# EasyEDA Pro project GeekTrack.eprj

# Schematic GeekTrack
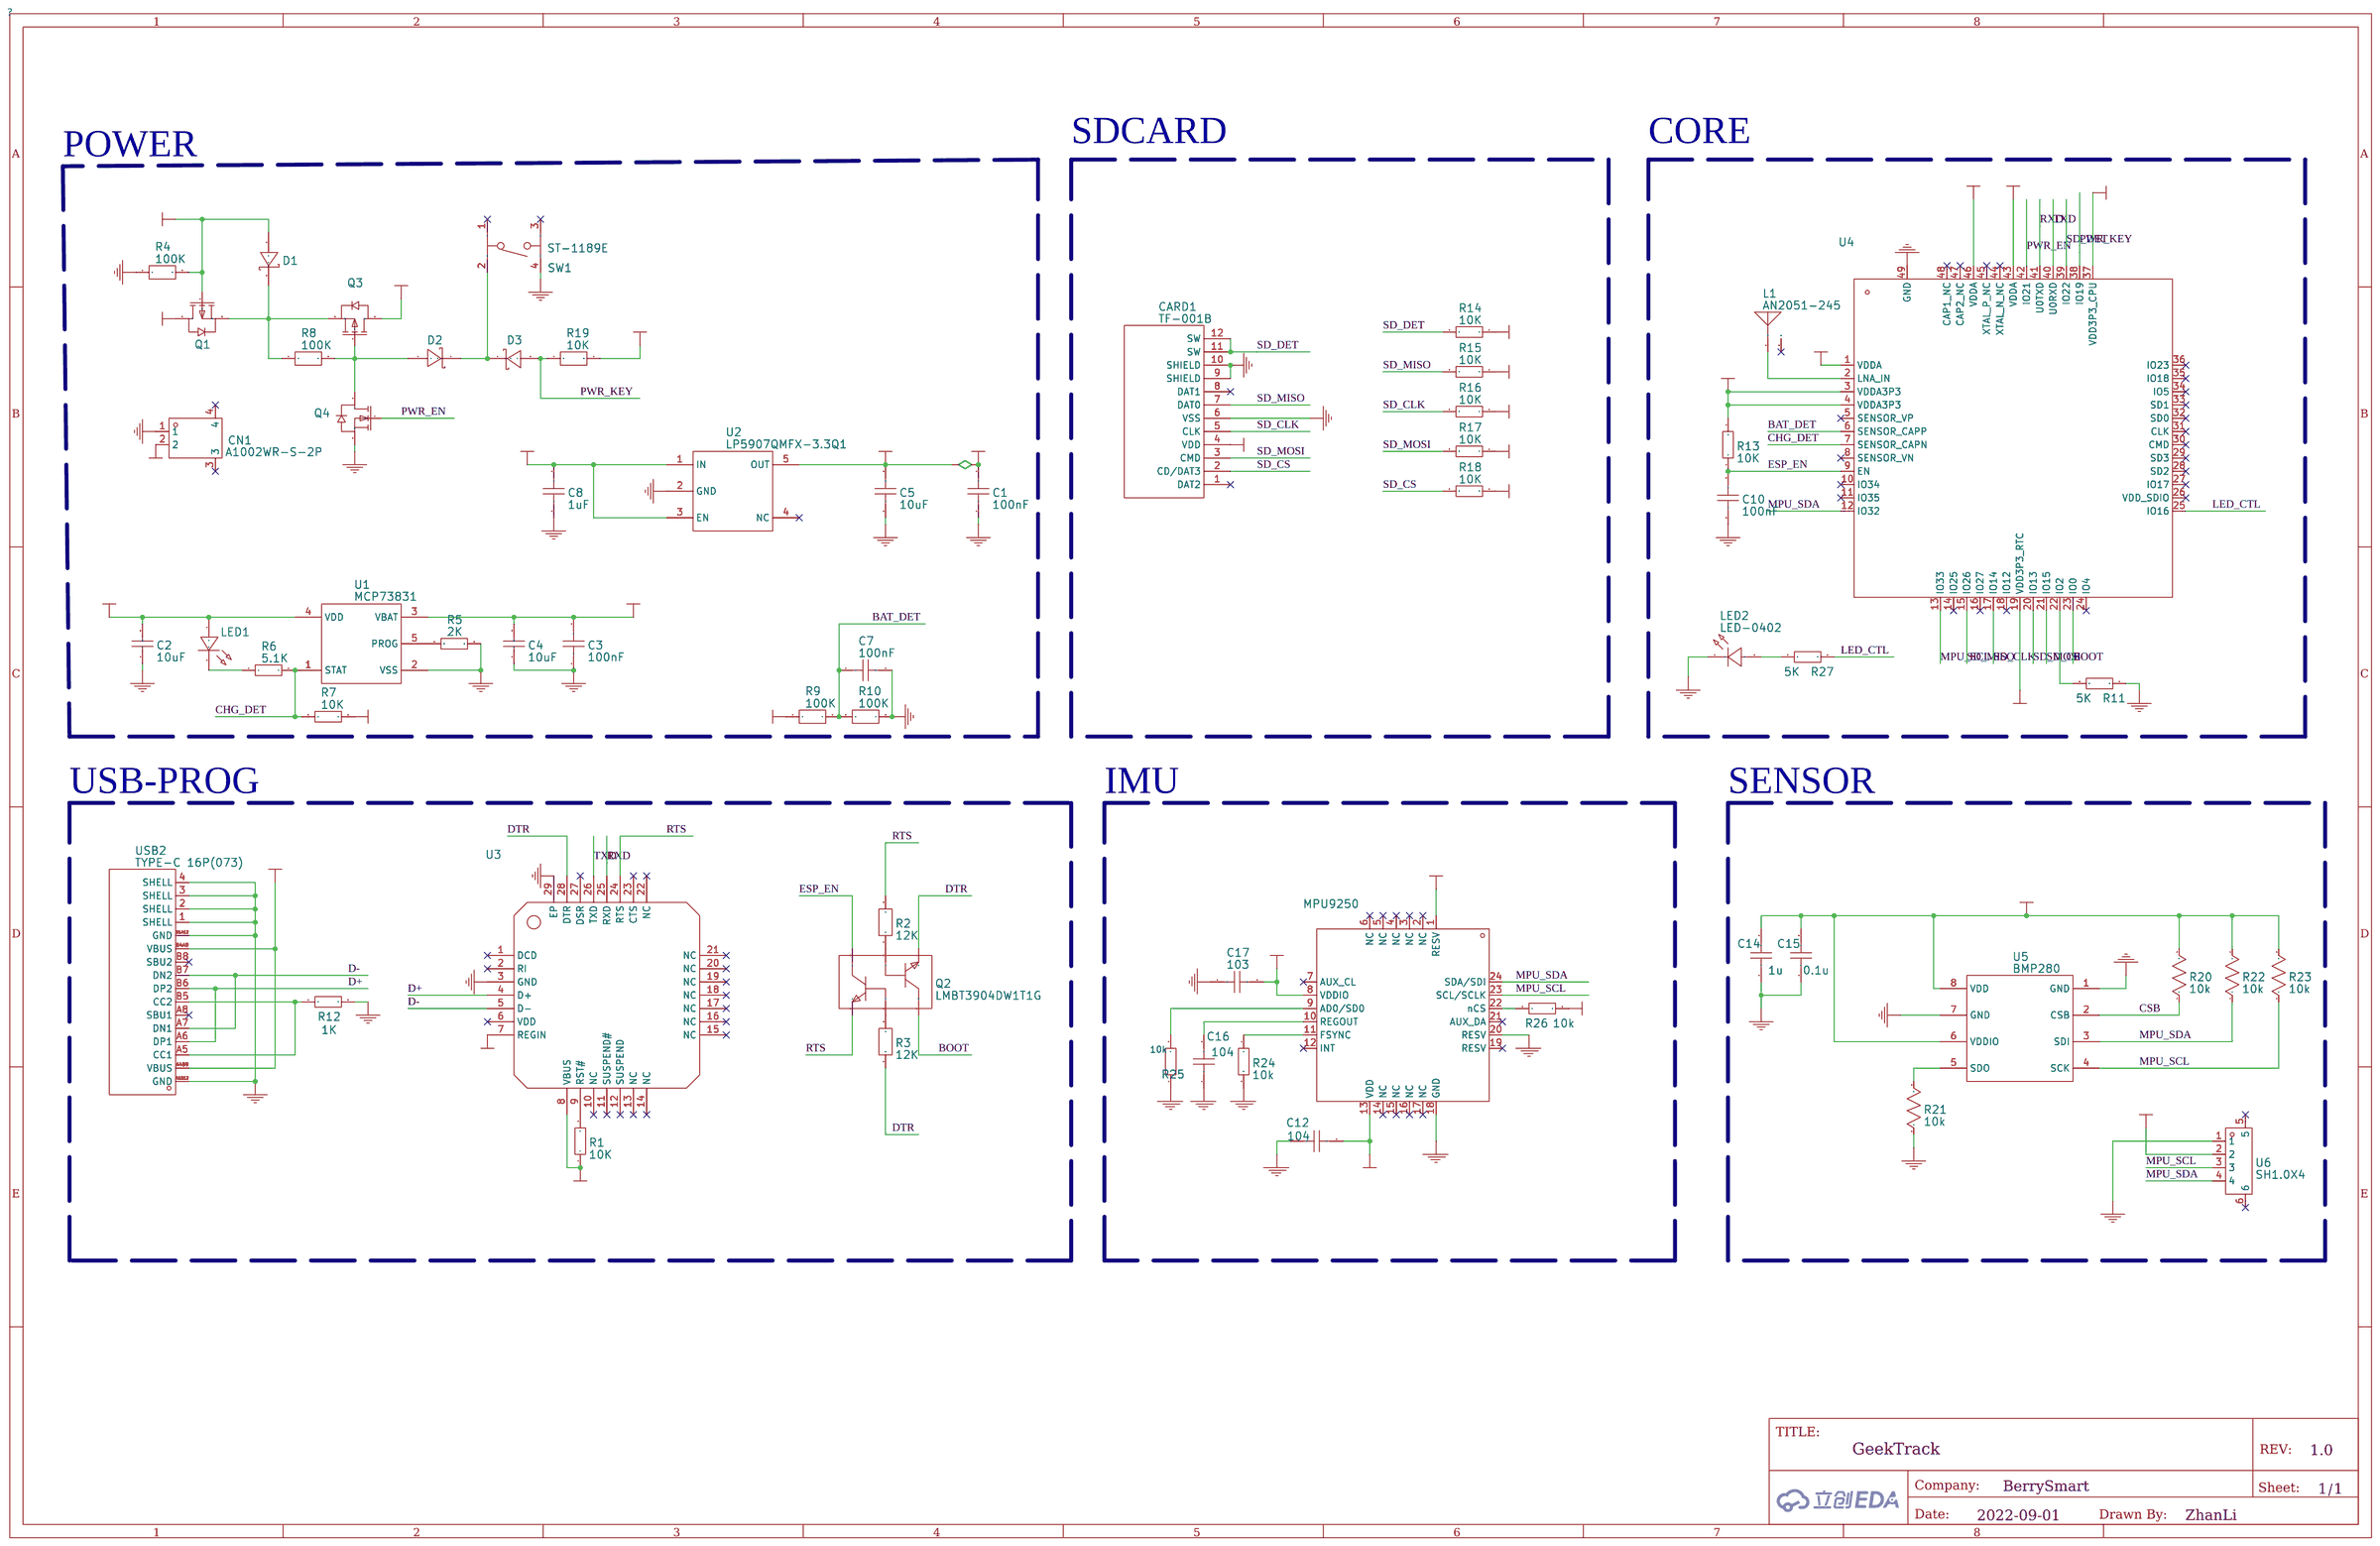
[diagram p0: schematic sheet]

## Parts
C1  100nF  [C0402]
C2  10uF  [C0402]
C3  100nF  [C0402]
C4  10uF  [C0402]
C5  10uF  [C0402]
C7  100nF  [C0402]
C8  1uF  [C0402]
C10  100nF  [C0402]
C12  104  [C0402]
C14  1u  [R0402]
C15  0.1u  [R0402]
C16  104  [C0402]
C17  103  [C0402]
CARD1  TF-001B  [TF-SMD_TF-001B]
CN1  A1002WR-S-2P  [CONN-SMD_A1002WR-S-2P]
D1  B5819WS_C122855  [SOD-323_L1.8-W1.3-LS2.5-RD]
D2  B5819WS_C122855  [SOD-323_L1.8-W1.3-LS2.5-RD]
D3  B5819WS_C122855  [SOD-323_L1.8-W1.3-LS2.5-RD]
L1  AN2051-245  [ANT2051]
LED1  LED-0603_R  [LED0603_RED]
LED2  LED-0402  [LED0402-RD]
MPU9250  MPU9250  [MPU9250]
Q1  AO3401A_C700954  [SOT-23-3_L2.9-W1.3-P1.90-LS2.4-BR]
Q2  LMBT3904DW1T1G  [SOT-363_L2.0-W1.3-P0.65-LS2.1-TL]
Q3  AO3401A_C700954  [SOT-23-3_L2.9-W1.3-P1.90-LS2.4-BR]
Q4  AO3400A_C700953  [SOT-23-3_L2.9-W1.3-P1.90-LS2.4-BR]
R1  10K  [R0402]
R2  12K  [R0402]
R3  12K  [R0402]
R4  100K  [R0402]
R5  2K  [R0402]
R6  5.1K  [R0402]
R7  10K  [R0402]
R8  100K  [R0402]
R9  100K  [R0402]
R10  100K  [R0402]
R11  5K  [R0402]
R12  1K  [R0402]
R13  10K  [R0402]
R14  10K  [R0402]
R15  10K  [R0402]
R16  10K  [R0402]
R17  10K  [R0402]
R18  10K  [R0402]
R19  10K  [R0402]
R20  10k  [R0402]
R21  10k  [R0402]
R22  10k  [R0402]
R23  10k  [R0402]
R24  10k  [R0402]
R25  10k  [R0402]
R26  10k  [R0402]
R27  5K  [R0402]
SW1  ST-1189E  [SW-SMD_ST-1189E]
U1  MCP73831  [SOT-23-5_L3.0-W1.7-P0.95-LS2.8-BR]
U2  LP5907QMFX-3.3Q1  [SOT-23-5_L3.0-W1.7-P0.95-LS2.8-BR]
U3  CP2102-GMR  [QFN-28_L5.0-W5.0-P0.50-BL-EP]
U4  ESP32-PICO-D4  [QFN-48_7X7X05P]
U5  BMP280  [SENSOR-TH_BMP280-BL]
U6  SH1.0X4  [CONN-SMD_SH1.0X4]
USB2  TYPE-C 16P(073)  [USB-C-SMD_TYPE-C16PIN_C668624]

## Library data of the parts
C1 C3 C7 C10 = CC0402KRX5R5BB104: Supplier: LCSC; Supplier Part: C541405; Manufacturer: YAGEO
C2 C4 = CL05A106MQ5NUNC: Supplier: LCSC; Manufacturer: SAMSUNG; Supplier Part: C15525; JLCPCB Part Class: Basic Part
C5 C8 = C0402C105K9PAC7867: Supplier: LCSC; Supplier Part: C141025; Manufacturer: KEMET; JLCPCB Part Class: Extended Part
C12 C16 = 104: link: https://item.szlcsc.com/15869.html; 3DModel: C0402_L1.0-W0.5-H0.5; Manufacturer Part: ?
C14 = 1u: link: https://item.szlcsc.com/323315.html; 3DModel: R0402_L1.0-W0.5-H0.5
C15 = 0.1u: link: https://item.szlcsc.com/323315.html; 3DModel: R0402_L1.0-W0.5-H0.5
C17 = 103: link: https://item.szlcsc.com/15869.html; 3DModel: C0402_L1.0-W0.5-H0.5; Manufacturer Part: ?
CARD1 = TF-001B: Supplier: LCSC; Manufacturer: SOFNG; Supplier Part: C125617; JLCPCB Part Class: Extended Part
CN1 = A1002WR-S-2P: Supplier: LCSC; Supplier Part: C239520; Manufacturer: Changjiang Connectors; JLCPCB Part Class: Extended Part
D1 = B5819WS: Supplier: LCSC; Manufacturer: SK; Supplier Part: C122855; JLCPCB Part Class: Extended Part
D2 D3 = B5819WS_C122855: link: https://item.szlcsc.com/295156.html; 3DModel: SOD-323_L1.7-W1.3-H1.1-LS2.5; Supplier: LCSC; Manufacturer: SK; Manufacturer Part: B5819WS; Supplier Part: C122855; JLCPCB Part Class: Extended Part
L1 = AN2051-245: Supplier: LCSC; Manufacturer: Rainsun; Supplier Part: C99727; JLCPCB Part Class: Extended Part
LED1 = 19-217/R6C-AL1M2VY/3T: Manufacturer: EVERLIGHT(台湾亿光); Supplier Part: C72044; Supplier: LCSC
LED2 = LED-0402: link: https://item.szlcsc.com/385873.html; 3DModel: LED0402_L1.0-W0.5-H0.2; Supplier: LCSC; Supplier Part: C917191; Manufacturer: TOGIALED; Manufacturer Part: TJ-S1005CL4T5ALC3DW-A5; JLCPCB Part Class: Extended Part
MPU9250 = MPU9250: Manufacturer Part: ?; 3DModel: QFN24_L4.0-W4.0-H1.0-P0.50
Q1 Q3 = AO3401A: Supplier: LCSC; Supplier Part: C700954; Manufacturer: HUASHUO(华朔); JLCPCB Part Class: Extended Part
Q2 = LMBT3904DW1T1G: Supplier: LCSC; Manufacturer: LRC; Supplier Part: C131781; JLCPCB Part Class: Extended Part
Q4 = AO3400A: Supplier: LCSC; Supplier Part: C700953; Manufacturer: HUASHUO(华朔); JLCPCB Part Class: Extended Part
R1 R7 R13-R18 = CR0402JF0103G: Supplier: LCSC; Manufacturer: LIZ; Supplier Part: C100572; JLCPCB Part Class: Extended Part
R2 R3 = CR0402F12K0Q10Z: Supplier: LCSC; Supplier Part: C881068; Manufacturer: Ever Ohms Tech
R4 R8-R10 = CR0402F100KQ10Z: Supplier: LCSC; Supplier Part: C881385; Manufacturer: Ever Ohms Tech
R5 = CR0402FF2001G: Supplier: LCSC; Manufacturer: LIZ; Supplier Part: C100291; JLCPCB Part Class: Extended Part
R6 R12 = RC0402JR-071KL: Supplier: LCSC; Manufacturer: YAGEO; Supplier Part: C105637; JLCPCB Part Class: Extended Part
R11 R27 = 5K: link: https://item.szlcsc.com/323315.html; 3DModel: R0402_L1.0-W0.5-H0.5; Supplier: LCSC; Manufacturer: LIZ; Manufacturer Part: CR0402JF0103G; Supplier Part: C100572; JLCPCB Part Class: Extended Part
R19 = 10K: link: https://item.szlcsc.com/323315.html; 3DModel: R0402_L1.0-W0.5-H0.5; Supplier: LCSC; Supplier Part: C881385; Manufacturer: Ever Ohms Tech; Manufacturer Part: CR0402F100KQ10Z
R20-R23 = 10k: link: https://item.szlcsc.com/323315.html; 3DModel: R0402_L1.0-W0.5-H0.5
R24-R26 = 10k: link: https://item.szlcsc.com/323315.html; 3DModel: R0402_L1.0-W0.5-H0.5; Manufacturer Part: ?
SW1 = ST-1189E: link: https://item.szlcsc.com/617095.html; Supplier: LCSC; Supplier Part: C589215; Manufacturer: RI SHENG; JLCPCB Part Class: Extended Part
U1 = MCP73831T-2ATI/OT: Supplier: LCSC; Manufacturer: MICROCHIP; Supplier Part: C14879; JLCPCB Part Class: Extended Part
U2 = LP5907QMFX-3.3Q1: Supplier: LCSC; Manufacturer: TI; Supplier Part: C130005; JLCPCB Part Class: Extended Part
U3 = CP2102-GMR: Supplier: LCSC; Manufacturer: SILICON LABS; Supplier Part: C6568; JLCPCB Part Class: Basic Part
U4 = ESP32-PICO-D4: Supplier: LCSC; Supplier Part: C193707; Manufacturer: Espressif Systems
U5 = BMP280: 3DModel: LGA-8_L2.0-W2.5-H1.0-P0.65; Supplier: LCSC; Manufacturer: Bosch; Supplier Part: C83291; JLCPCB Part Class: Extend
U6 = SH1.0X4: link: https://cn.bing.com/search?q=datasheet: SH1.0X4; Supplier: LCSC; Supplier Part: C9900002342; Manufacturer: null; Manufacturer Part: SH1.0X4卧贴; JLCPCB Part Class: Extended Part
USB2 = TYPE-C 16P(073): Supplier: LCSC; Supplier Part: C668624; Manufacturer: SHOU HAN

## Nets
3V3A: C1.2 C5.2 C12.2 C14.2 C15.2 C17.2 CARD1.4(VDD) MPU9250.1(RESV) MPU9250.8(VDDIO) MPU9250.13(VDD) R7.2 R13.2 R14.1 R15.1 R16.1 R17.1 R18.1 R19.2 R20.2 R22.2 R23.2 R26.2 U2.5(OUT) U4.1(VDDA) U4.3(VDDA3P3) U4.4(VDDA3P3) U4.19(VDD3P3_RTC) U4.37(VDD3P3_CPU) U4.43(VDDA) U4.46(VDDA) U5.6(VDDIO) U5.8(VDD) U6.2
GND: C1.1 C2.1 C3.1 C4.1 C5.1 C7.2 C8.1 C10.1 C12.1 C14.1 C15.1 C16.1 C17.1 CARD1.6(VSS) CARD1.9(SHIELD) CARD1.10(SHIELD) CN1.1 LED2.1(K) MPU9250.18(GND) MPU9250.20(RESV) Q4.2(S) R4.1 R5.2 R10.2 R11.1 R12.2 R21.1 R24.2 R25.1 SW1.4 U1.2(VSS) U2.2(GND) U3.3(GND) U3.29(EP) U4.49(GND) U5.1(GND) U5.7(GND) U6.1 USB2.1(SHELL) USB2.2(SHELL) USB2.3(SHELL) USB2.4(SHELL) USB2.A1B12(GND) USB2.B1A12(GND)
VBAT: C3.2 C4.2 CN1.2 Q1.3(D) U1.3(VBAT)
VCC: C8.2 Q3.3(D) R9.1 U2.1(IN) U2.3(EN)
BAT_DET: C7.1 R9.2 R10.1 U4.6(SENSOR_CAPP)
BOOT: Q2.3(C) U4.23(IO0)
CHG_DET: R6.2 R7.1 U1.1(STAT) U4.7(SENSOR_CAPN)
CSB: R20.1 U5.2(CSB)
D+: U3.4(D+) USB2.A6(DP1) USB2.B6(DP2)
D-: U3.5(D-) USB2.A7(DN1) USB2.B7(DN2)
DTR: Q2.4(E) R3.1 U3.28(DTR)
ESP_EN: C10.2 Q2.6(C) R13.1 U4.9(EN)
LED_CTL: R27.1 U4.25(IO16)
MPU_SCL: MPU9250.23(SCL/SCLK) R23.1 U4.13(IO33) U5.4(SCK) U6.3
MPU_SDA: MPU9250.24(SDA/SDI) R22.1 U4.12(IO32) U5.3(SDI) U6.4
PWR_EN: Q4.1(G) U4.42(IO21)
PWR_KEY: D3.2(A) R19.1 U4.38(IO19)
RTS: Q2.1(E) R2.2 U3.24(RTS)
RXD: U3.25(RXD) U4.41(U0TXD)
SD_CLK: CARD1.5(CLK) R16.2 U4.17(IO14)
SD_CS: CARD1.2(CD/DAT3) R18.2 U4.21(IO15)
SD_DET: CARD1.11(SW) CARD1.12(SW) R14.2 U4.39(IO22)
SD_MISO: CARD1.7(DAT0) R15.2 U4.15(IO26)
SD_MOSI: CARD1.3(CMD) R17.2 U4.20(IO13)
TXD: U3.26(TXD) U4.40(U0RXD)
VUSB: C2.2 D1.2(A) LED1.1 Q1.1(G) R1.1 R4.2 U1.4(VDD) U3.7(REGIN) U3.8(VBUS) USB2.A4B9(VBUS) USB2.B4A9(VBUS)
Net-(C16-2): C16.2 MPU9250.10(REGOUT)
Net-(D1-1): D1.1(K) Q1.2(S) Q3.2(S) R8.1
Net-(D2-1): D2.1(K) D3.1(K) SW1.2
Net-(D2-2): D2.2(A) Q3.1(G) Q4.3(D) R8.2
Net-(L1-1): L1.1(ANT) U4.2(LNA_IN)
Net-(LED1-2): LED1.2 R6.1
Net-(LED2-2): LED2.2(A) R27.2
Net-(MPU9250-9): MPU9250.9(AD0/SD0) R25.2
Net-(MPU9250-11): MPU9250.11(FSYNC) R24.1
Net-(MPU9250-22): MPU9250.22(nCS) R26.1
Net-(Q2-2): Q2.2(B) R3.2
Net-(Q2-5): Q2.5(B) R2.1
Net-(R1-2): R1.2 U3.9(RST#)
Net-(R5-1): R5.1 U1.5(PROG)
Net-(R11-2): R11.2 U4.22(IO2)
Net-(R12-1): R12.1 USB2.A5(CC1) USB2.B5(CC2)
Net-(R21-2): R21.2 U5.5(SDO)

Not connected (* = marked no-connect by the designer): CARD1 1(DAT2)* 8(DAT1)*; CN1 3* 4*; L1 2*; MPU9250 2(NC)* 3(NC)* 4(NC)* 5(NC)* 6(NC)* 7(AUX_CL)* 12(INT)* 14(NC)* 15(NC)* 16(NC)* 17(NC)* 19(RESV)* 21(AUX_DA)*; SW1 1* 3*; U2 4(NC)*; U3 1(DCD)* 2(RI)* 6(VDD)* 10(NC)* 11(SUSPEND#)* 12(SUSPEND)* 13(NC)* 14(NC)* 15(NC)* 16(NC)* 17(NC)* 18(NC)* 19(NC)* 20(NC)* 21(NC)* 22(NC)* 23(CTS)* 27(DSR)*; U4 5(SENSOR_VP)* 8(SENSOR_VN)* 10(IO34)* 11(IO35)* 14(IO25)* 16(IO27)* 18(IO12)* 24(IO4)* 26(VDD_SDIO)* 27(IO17)* 28(SD2)* 29(SD3)* 30(CMD)* 31(CLK)* 32(SD0)* 33(SD1)* 34(IO5)* 35(IO18)* 36(IO23)* 44(XTAL_N_NC)* 45(XTAL_P_NC)* 47(CAP2_NC)* 48(CAP1_NC)*; U6 5* 6*; USB2 A8(SBU1)* B8(SBU2)*

## Notes on the sheet
- SDCARD
- CORE
- POWER
- USB-PROG
- IMU
- SENSOR
